# Altium schematic sheet LogicPower.SchDoc
size A3; SheetNumber: 4; SheetTotal: 6; SPICEModelCacheUIACBXDH: <root> / <DocumentId>UIACBXDH</DocumentId> / <CacheFrame Number="0"> / <Model Name="cap" Kind="MDL"> / <Text>*Default semiconductor capacitor / .MODEL CAP C()</Text> / </Model> / </CacheFrame> / </root>
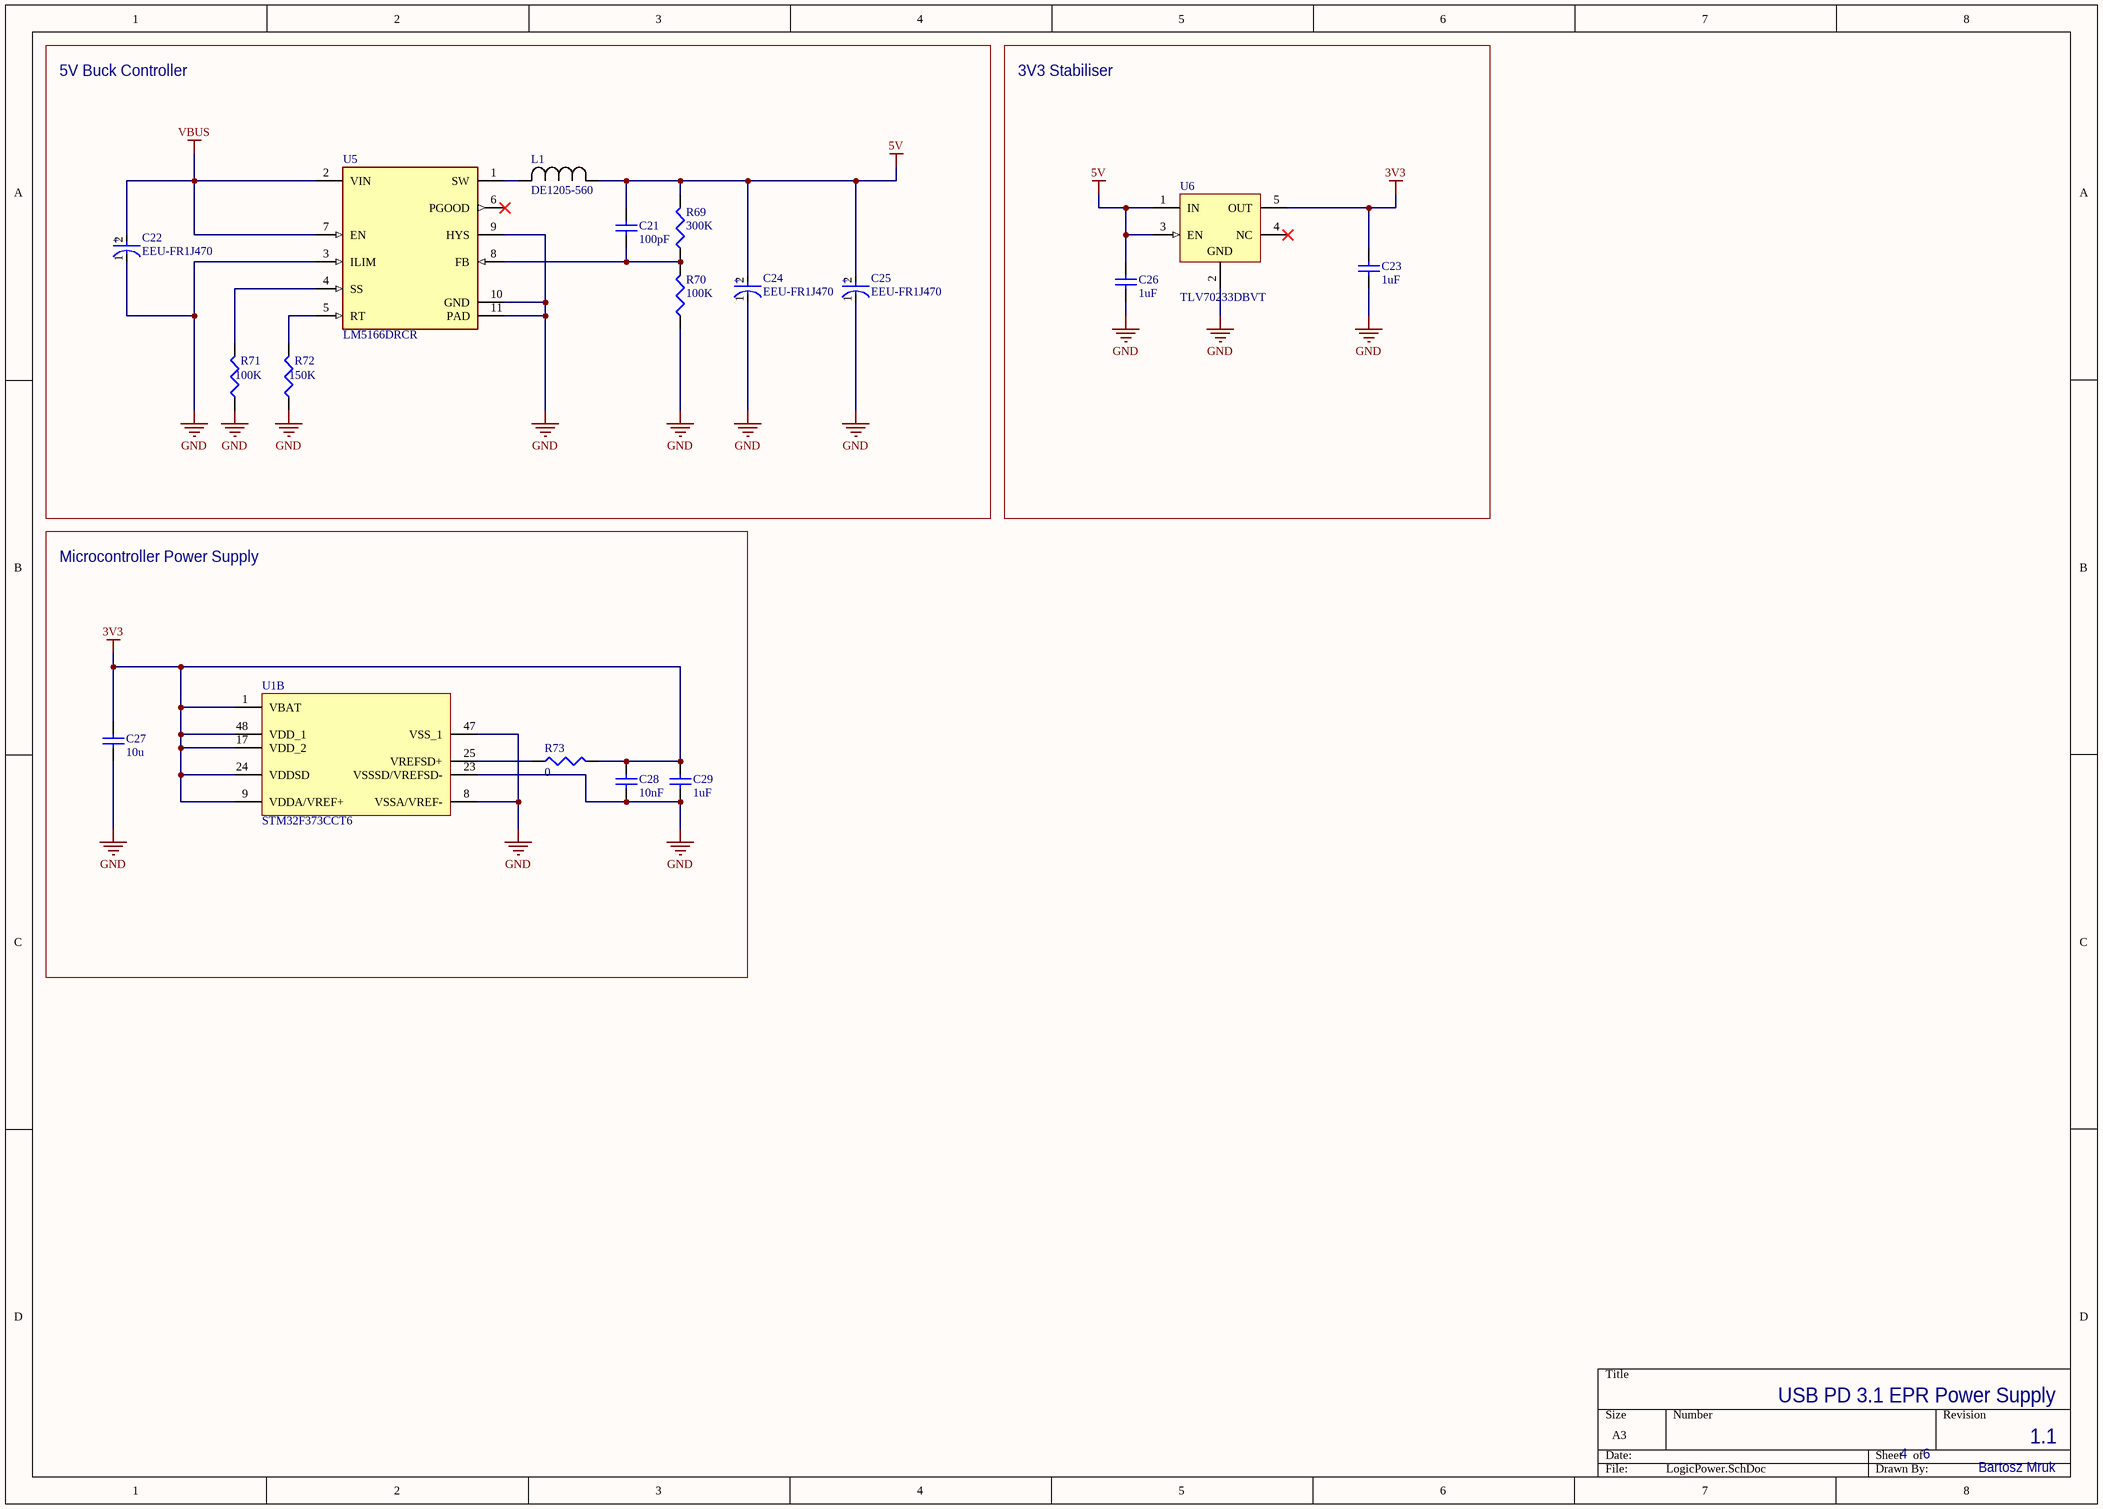
[diagram p0: LogicPower.SchDoc]

## Parts
C21  value 100pF  [C1206]  (hidden comment: Cap Semi)
C22  EEU-FR1J470  [FP-EEU-FR1J470-MFG]
C23  value 1uF  [C1206]  (hidden comment: Cap Semi)
C24  EEU-FR1J470  [FP-EEU-FR1J470-MFG]
C25  EEU-FR1J470  [FP-EEU-FR1J470-MFG]
C26  value 1uF  [C1206]  (hidden comment: Cap Semi)
C27  value 10u  [C1206]  (hidden comment: Cap Semi)
C28  value 10nF  [C1206]  (hidden comment: Cap Semi)
C29  value 1uF  [C1206]  (hidden comment: Cap Semi)
L1  DE1205-560  [IND_DE1205_FRC]
R69  value 300K  [J1-0603]  (hidden comment: Res3)
R70  value 100K  [J1-0603]  (hidden comment: Res3)
R71  value 100K  [J1-0603]  (hidden comment: Res3)
R72  value 150K  [J1-0603]  (hidden comment: Res3)
R73  value 0  [J1-0603]  (hidden comment: Res3)
U1  STM32F373CCT6  [STM-LQFP48_M]  (part B of 2)
U5  LM5166DRCR  [FP-DRC0010J-MFG]
U6  TLV70233DBVT  [DBV0005A_M]

## Blocks framed on the sheet
5V Buck Controller: C21 C22 C24 C25 L1 R69-R72 U5
3V3 Stabiliser: C23 C26 U6
Microcontroller Power Supply: C27-C29 R73 U1

## Nets
3V3: C23.2 C27.2 C28.2 C29.2 R73.2 U1.1(VBAT) U1.9(VDDA/VREF+) U1.17(VDD_2) U1.24(VDDSD) U1.48(VDD_1) U6.5(OUT)
5V: C21.2 C24.2(A) C25.2(A) C26.2 L1.1 R69.2 U6.1(IN) U6.3(EN)
GND: C22.1(C) C23.1 C24.1(C) C25.1(C) C26.1 C27.1 C28.1 C29.1 R70.1 R71.1 R72.1 U1.8(VSSA/VREF-) U1.23(VSSSD/VREFSD-) U1.47(VSS_1) U5.3(ILIM) U5.9(HYS) U5.10(GND) U5.11(PAD) U6.2(GND)
VBUS: C22.2(A) U5.2(VIN) U5.7(EN)
NetC21_1: C21.1 R69.1 R70.2 U5.8(FB)
NetL1_2: L1.2 U5.1(SW)
NetR71_2: R71.2 U5.4(SS)
NetR72_2: R72.2 U5.5(RT)
NetR73_1: R73.1 U1.25(VREFSD+)

Not connected (* = marked no-connect by the designer): U5 6(PGOOD)*; U6 4(NC)*

## Notes on the sheet
- 4
- 6
- 1.1
- USB PD 3.1 EPR Power Supply
- Bartosz Mruk
- (in symbol CMP-05427-000066-1) +

## Library data of the parts
C21 C23 C26-C29 = Cap Semi: Capacitor (Semiconductor SIM Model); Published: 8-Jun-2000; LatestRevisionDate: 29-May-2009; LatestRevisionNote: IPC-7351 Footprint Added.; PackageReference: C1206; Publisher: Altium Limited; PackageDescription: Chip Capacitor
C22 C24 C25 = CMP-05427-000066-1: CAP ALUM 47UF 20% 63V RADIAL; ESR (Equivalent Series Resistance): 210mR; Lead Diameter: 0.5mm; Life (Hours): 5000Hour; Ripple Current (AC): 284mA; Height - Seated (Max): 0.5inch; Radiation Hardening: No; Termination: Radial; Contact Plating: Tin; Length: 11.2mm; Tolerance: 20%; Voltage: 63V; Max Operating Temperature: 105°C; Construction: Cylindrical; Lead Free: Lead Free; Series: FR; Mount: Through Hole; Lead Pitch: 2.5mm; Capacitance: 47uF; Case/Package: Radial; Voltage Rating (DC): 63V; Diameter: 6.3mm; Impedance: 210mR; RoHS Compliant: Yes; Height: 11.2mm; REACH SVHC: No SVHC; Package Quantity: 200; Ripple Current: 284mA; Voltage Rating: 63V; Packaging: Bulk; Min Operating Temperature: -40°C
L1 = DE1205-560: Description; Manufacturer_Name: FerroCore; Copyright: Copyright (C) 2025 Ultra Librarian. All rights reserved.; Manufacturer_Part_Number: DE1205-560
R69-R73 = Res3: Resistor; Published: 8-Jun-2000; LatestRevisionDate: 29-May-2009; LatestRevisionNote: IPC-7351 Footprint Added.; PackageReference: J1-0603; Publisher: Altium Limited; PackageDescription: Chip Resistor
U1 = CMP-0572-00021-2: ARM Cortex-M4 32-bit MCU, 256 KB Flash, 32 KB Internal RAM, 36 I/Os, 48-pin LQFP, -40 to 85 degC, Tray; FLASH Size (Prog) (kB): 256; Internal RAM Size (kB): 32; Operating Frequency(F) (Processor speed) (MHz): 72; I/Os (High Current): 36; Supply Voltage(Vcc) min (V): 2; Mounting Technology: Surface Mount; ComponentLink2Description: Datasheet; PackageReference: LQFP48; Packing: Tray; PackageVersion: Rev. 6, 06/2013; ComponentLink1Description: Manufacturer URL; ComponentLink3Description: Package Specification; ComponentLink2URL: http://www.st.com/st-web-ui/static/active/en/resource/technical/document/datasheet/DM00046749.pdf; PartNumber: STM32F373CCT6; Core: ARM Cortex-M4; ComponentLink1URL: http://www.st.com/web/en/home.html; ComponentLink3URL: http://www.st.com/st-web-ui/static/active/en/resource/technical/document/datasheet/DM00058181.pdf; DatasheetVersion: Rev. 3; PackageDescription: 48-Pin Low Profile Quad Flat Package, 7 x 7 mm Body, 0.5 mm Pitch
U5 = CMP-04918-000087-1: IC REG BUCK ADJ 500MA 10VSON; Manufacturer: Texas Instruments; Output Voltage: 1.23-65V; Switching Frequency: 50-600kHz; Nominal Supply Current: 205-320uA; Max Supply Voltage: 65V; Min Supply Voltage: 3V; Output Type: AdjustableProgrammable; Max Duty Cycle: 100%; Max Junction Temp: +150°C; Standoff Height: 0mm; Number Of Outputs: 1; Temperature Range Low: -40°C; Octopart: https://octopart.com/lm5166drcr-texas+instruments-77040222; Height: 1mm; Temperature: -40°C to +150°C; ComponentLink2Description: Datasheet; Device Class L1: Integrated Circuits (ICs); ComponentLink2URL: http://www.ti.com/lit/ds/symlink/lm5166.pdf; Device Class L3: Voltage Regulators - Switching; Lead Free: Yes; Manufacturer Part Number: LM5166DRCR; RoHS: TRUE; Switching Topology: Buck; Package: DRC0010J; Digikey Description: IC REG BUCK ADJ 500MA 10VSON; Temperature Range High: +150°C; Output Current: 500mA; Category: IC; Automotive: No; Device Class L2: Power Management ICs
U6 = CMP-0394-00524-3: None; Max Output Voltage: 3.3V; Min Input Voltage: 2V; Quiescent Current: 30uA; Accuracy: 2%; Number of Outputs: 1; Power Dissipation: 500mW; Dropout Voltage: 220mV; Output Voltage Accuracy: 0.5%; Max Output Current: 300mA; Polarity: Positive; Power Supply Rejection Ratio (PSRR): 68dB; Output Type: Fixed; Max Input Voltage: 5.5V; Min Current Limit: 320mA; REACH SVHC: No SVHC; RoHS Compliant: Yes; Length: 3.05mm; Radiation Hardening: No; Lead Free: Lead Free; Height: 1.45mm; Output Voltage: 3.3V; Min Operating Temperature: -40°C; Package Quantity: 1; Width: 1.75mm; Number of Regulators: 1; Case/Package: SOT-23; Number of Pins: 5; Output Current: 300mA; Packaging: Tape and Reel; Min Output Voltage: 3.3V; Max Operating Temperature: 125°C; Series: -; Nominal Output Voltage: 3.3V; Max Power Dissipation: 500mW